# EAGLE design pcb 1 (EAGLE 6.1)
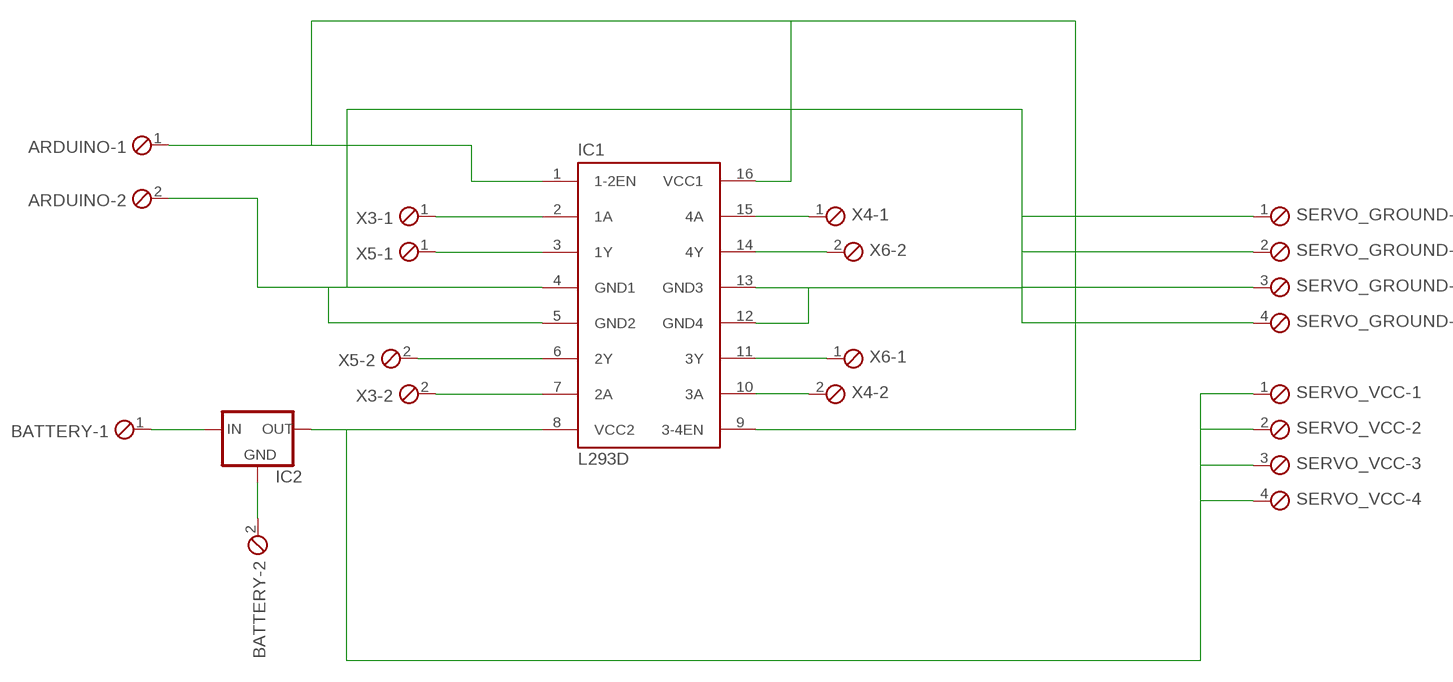
[diagram p0: schematic, sheet 1]

## Parts
ARDUINO  MPT2  [2POL254]
BATTERY  MPT2  [2POL254]
IC1  L293D  [DIL16]
IC2  78MXXS  [78MXXS]
SERVO_GROUND  MPT4  [4POL254]
SERVO_VCC  MPT4  [4POL254]
X3  MPT2  [2POL254]
X4  MPT2  [2POL254]
X5  MPT2  [2POL254]
X6  MPT2  [2POL254]

## Nets
N$1: IC1.2(1A) X3.1
N$2: IC1.7(2A) X3.2
N$3: IC1.15(4A) X4.1
N$4: IC1.10(3A) X4.2
N$5: IC1.14(4Y) X6.2
N$6: IC1.11(3Y) X6.1
N$7: IC1.3(1Y) X5.1
N$8: IC1.6(2Y) X5.2
N$9: BATTERY.1 IC2.IN
N$10: BATTERY.2 IC2.GND
N$11: IC1.8(VCC2) IC2.OUT SERVO_VCC.1 SERVO_VCC.2 SERVO_VCC.3 SERVO_VCC.4
N$12: ARDUINO.2 IC1.4(GND1) IC1.5(GND2) IC1.12(GND4) IC1.13(GND3) SERVO_GROUND.1 SERVO_GROUND.2 SERVO_GROUND.3 SERVO_GROUND.4
N$13: ARDUINO.1 IC1.1(1-2EN) IC1.9(3-4EN) IC1.16(VCC1)

## Library data of the parts
ARDUINO BATTERY X3-X6 = con-phoenix-254:MPT2: PHOENIX CONNECTOR; OC_FARNELL: unknown; OC_NEWARK: unknown
IC1 = st-microelectronics:L293D: PUSH-PULL 4 CHANNEL DRIVER; MPN: L293D; OC_FARNELL: 9589619; OC_NEWARK: 56P8249
IC2 = v-reg:78MXXS: VOLTAGE REGULATOR
SERVO_GROUND SERVO_VCC = con-phoenix-254:MPT4: PHOENIX CONNECTOR; OC_FARNELL: unknown; OC_NEWARK: unknown

## Board
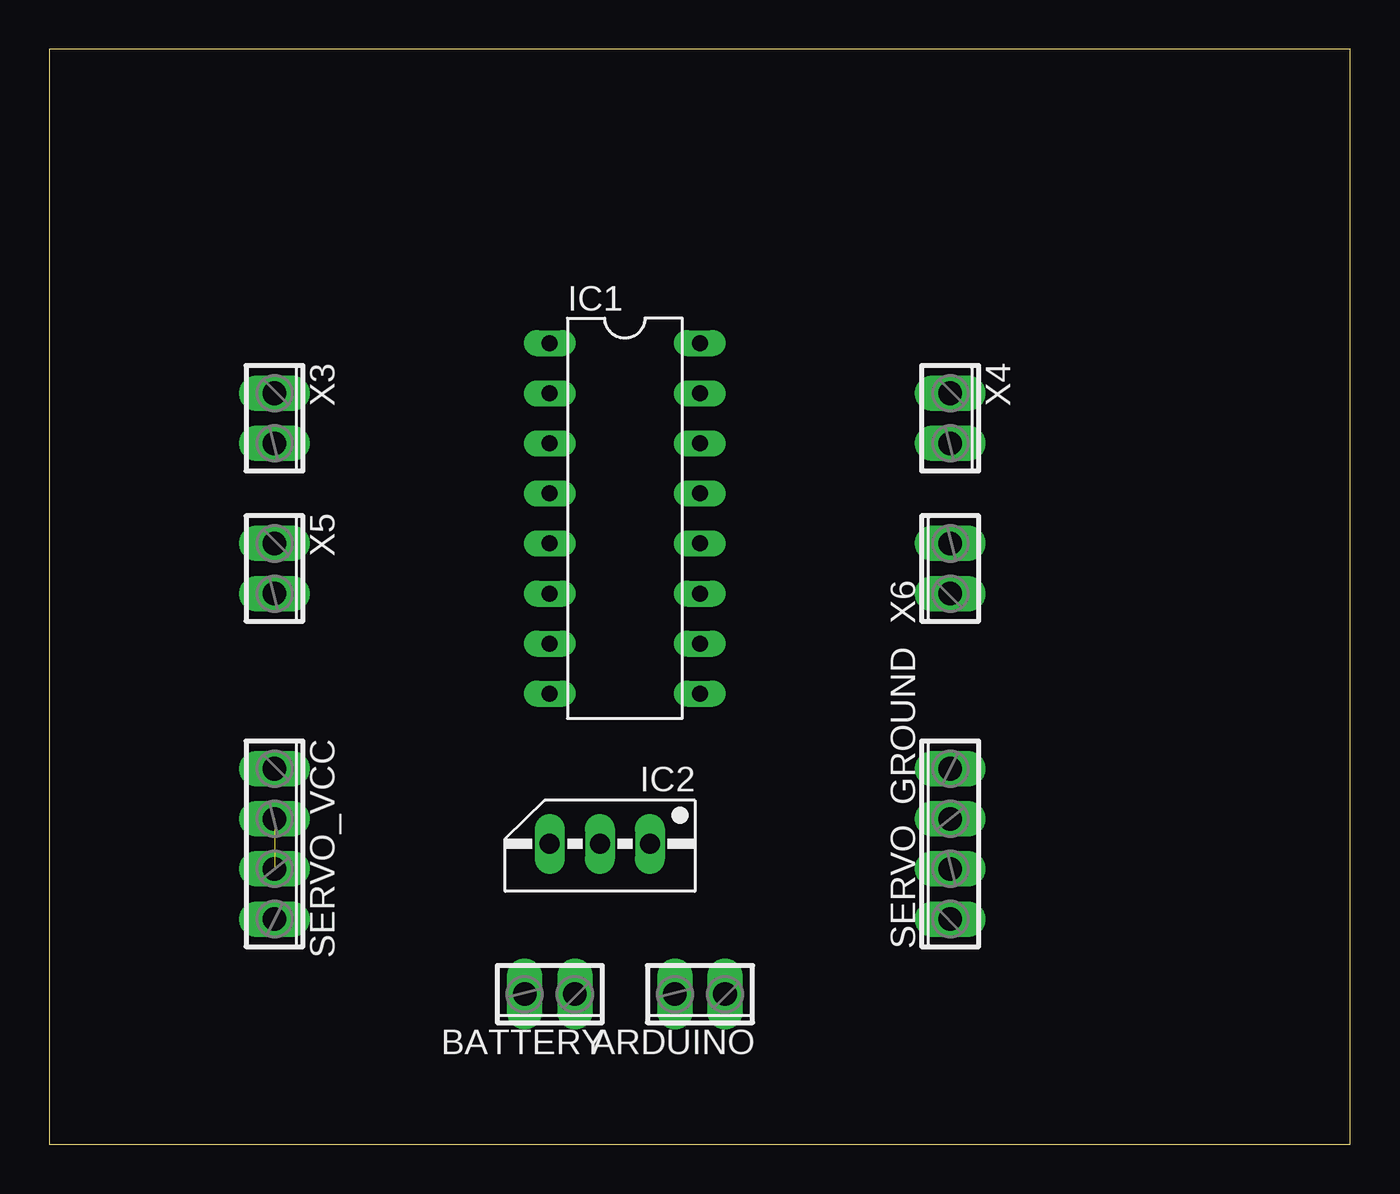
[diagram p1: board, top side]
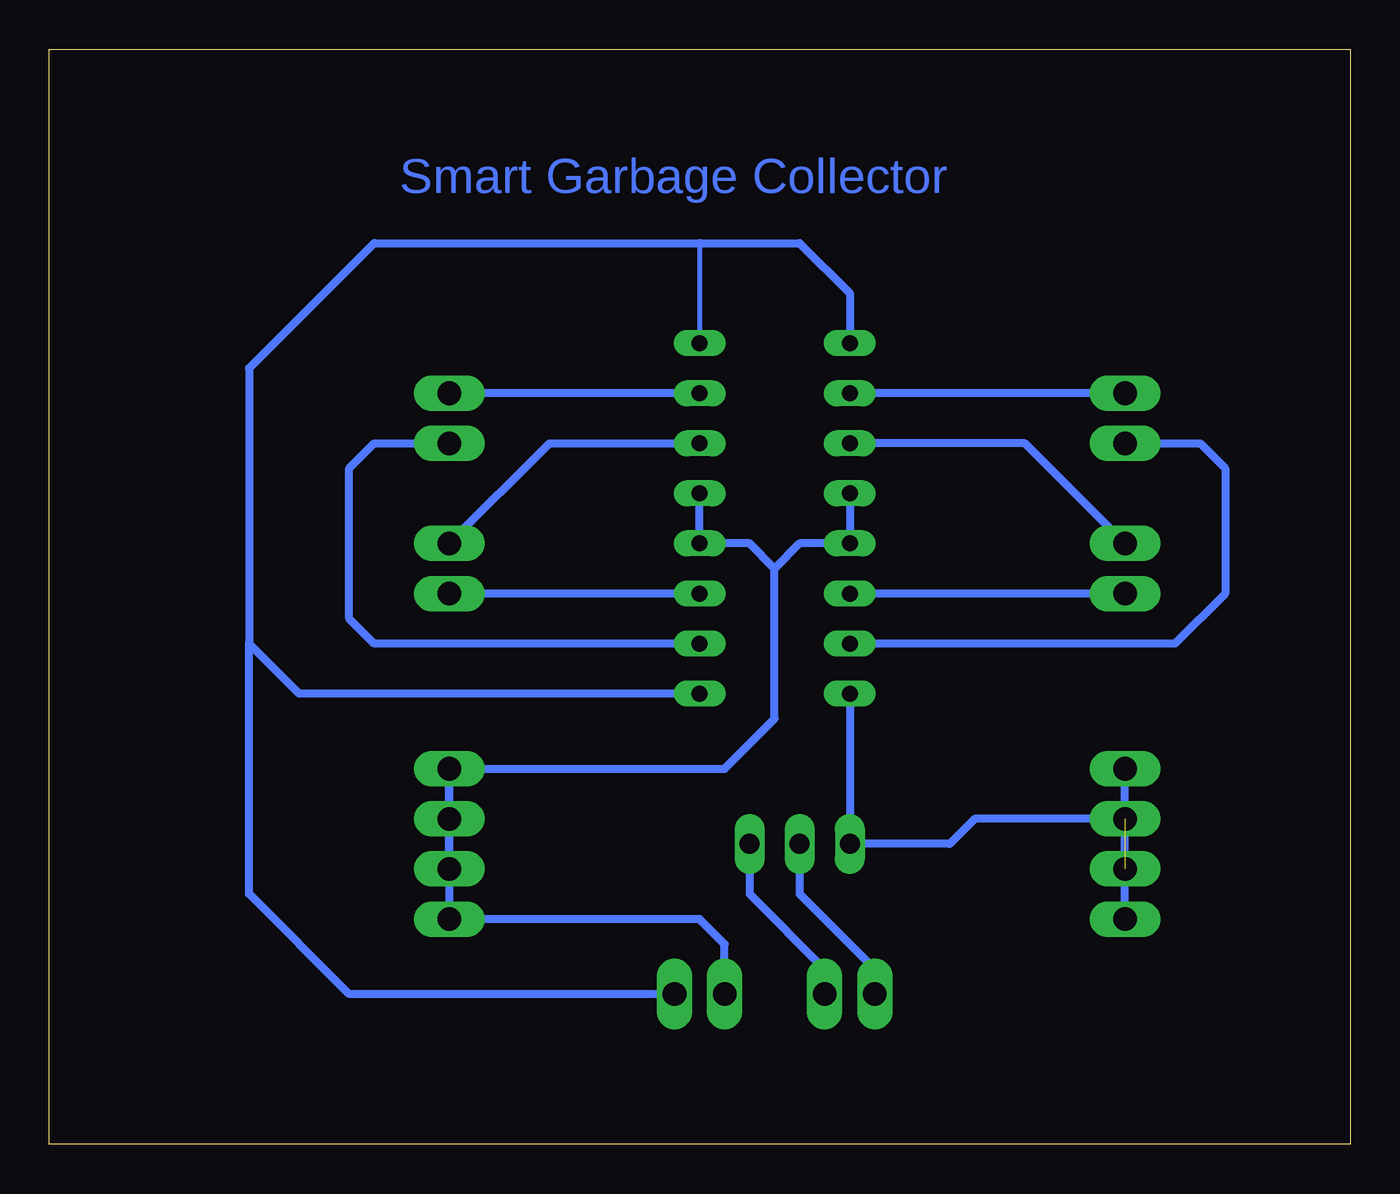
[diagram p2: board, bottom side, seen from below]

Size 66.02 x 55.55 mm. Coordinates in mm from the lower left corner, seen from the top.
Outline: 0,0 66.02,0 66.02,55.55 0,55.55 0,0
Copper layers (1*16): Top 0.035mm / dielectric 1.5mm / Bottom 0.035mm
Design rules: minimum track width 10mil, minimum drill 24mil, track to track 8mil, track to pad 8mil, pad to pad 8mil, via to via 8mil, smd to smd 8mil, copper to edge 40mil, drill to drill 8mil, minimum pad ring 10mil, minimum via ring 8mil, stop-mask expansion 4mil, vias tented up to drill 0mil, thermal gap 10mil

### Footprints (pad centres in the part's own frame; a part is rotated, then mirrored left to right if it is on the bottom)
2POL254 = drill 1.2 long: 1 -1.27,0; 2 1.27,0
DIL16 = drill 0.813 long: 1 -8.89,-3.81; 2 -6.35,-3.81; 3 -3.81,-3.81; 4 -1.27,-3.81; 5 1.27,-3.81; 6 3.81,-3.81; 7 6.35,-3.81; 8 8.89,-3.81; 9 8.89,3.81; 10 6.35,3.81; 11 3.81,3.81; 12 1.27,3.81; 13 -1.27,3.81; 14 -3.81,3.81; 15 -6.35,3.81; 16 -8.89,3.81
78MXXS = drill 1.016 long: GND 0,-2.54; IN -2.54,-2.54; OUT 2.54,-2.54
4POL254 = drill 1.2 long: 1 -3.81,0; 2 -1.27,0; 3 1.27,0; 4 3.81,0

### Placement (x,y rotation side)
ARDUINO  33.02,7.62 180 top
BATTERY  25.4,7.62 180 top
IC1  29.21,31.75 270 top
IC2  27.94,12.7 180 top
SERVO_GROUND  45.72,15.24 90 top
SERVO_VCC  11.43,15.24 270 top
X3  11.43,36.83 270 top
X4  45.72,36.83 270 top
X5  11.43,29.21 270 top
X6  45.72,29.21 90 top

### Tracks (layer width: path | path; a pad name or v marks a point on that pad's centre or on a via)
N$1
  Bottom 0.406: X3.1 IC1.2
N$2
  Bottom 0.406: X3.2 7.62,35.56 6.35,34.29 6.35,27.94 8.89,25.4 IC1.7
N$3
  Bottom 0.406: IC1.15 X4.1
N$4
  Bottom 0.406: IC1.10 49.53,25.4 50.8,26.67 50.8,34.29 49.53,35.56 X4.2
N$5
  Bottom 0.406: X6.2 40.64,35.56 IC1.14
N$6
  Bottom 0.406: IC1.11 X6.1
N$7
  Bottom 0.406: X5.1 16.51,35.56 IC1.3
N$8
  Bottom 0.406: X5.2 IC1.6
N$9
  Bottom 0.406: IC2.IN 30.48,12.7 26.67,8.89 BATTERY.1
N$10
  Bottom 0.406: IC2.GND 27.94,12.7 24.13,8.89 BATTERY.2
N$11  (1 unrouted)
  Bottom 0.406: IC1.8 IC2.OUT 20.32,15.24 19.05,16.51 SERVO_VCC.2 | SERVO_VCC.4 SERVO_VCC.2 | SERVO_VCC.2 SERVO_VCC.1
N$12
  Bottom 0.406: SERVO_GROUND.1 SERVO_GROUND.2 SERVO_GROUND.3 SERVO_GROUND.4 | SERVO_GROUND.4 SERVO_GROUND.1 | IC1.13 IC1.12 30.48,30.48 29.21,29.21 | SERVO_GROUND.4 31.75,19.05 29.21,21.59 29.21,29.21 | IC1.4 IC1.5 27.94,30.48 29.21,29.21 | ARDUINO.2 31.75,10.16 33.02,11.43 SERVO_GROUND.1
N$13
  Bottom 0.254: 33.02,45.72 IC1.16
  Bottom 0.406: ARDUINO.1 50.8,7.62 55.88,12.7 55.88,25.4 | IC1.1 25.4,43.18 27.94,45.72 33.02,45.72 49.53,45.72 55.88,39.37 55.88,25.4 | IC1.9 53.34,22.86 55.88,25.4

### Text on the board
Bottom: Smart Garbage Collector